# Altium schematic sheet Power.SchDoc
size A4
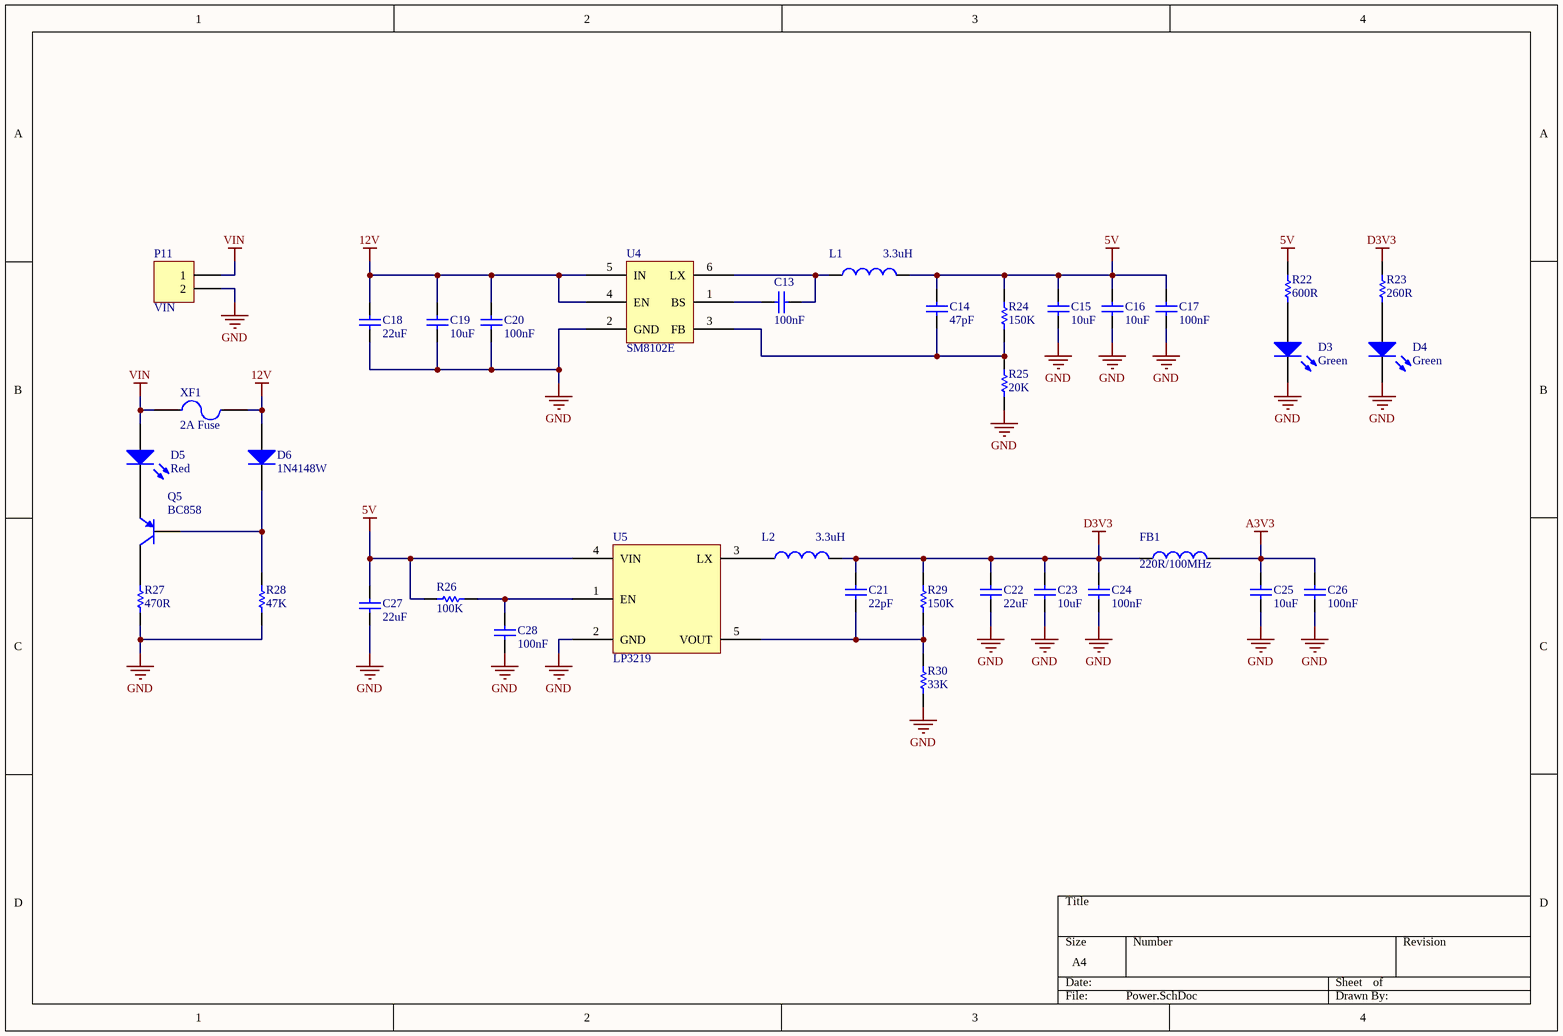
[diagram p0: Power.SchDoc]

## Parts
C13  100nF  [CAP0603]
C14  47pF  [CAP0603]
C15  10uF  [CAP0805]
C16  10uF  [CAP0805]
C17  100nF  [CAP0603]
C18  22uF  [CAP0805]
C19  10uF  [CAP0805]
C20  100nF  [CAP0603]
C21  22pF  [CAP0603]
C22  22uF  [CAP0805]
C23  10uF  [CAP0805]
C24  100nF  [CAP0603]
C25  10uF  [CAP0805]
C26  100nF  [CAP0603]
C27  22uF  [CAP0805]
C28  100nF  [CAP0603]
D3  Green  [DIODE0603]
D4  Green  [DIODE0603]
D5  Red  [DIODE0603]
D6  1N4148W  [SOD-123]
FB1  220R/100MHz  [IND0603]
L1  3.3uH  [IND4x4x1.8]
L2  3.3uH  [IND4x4x1.8]
P11  VIN  [SCREW TERMINAL 5MM]
Q5  BC858  [SOT-23]
R22  600R  [RES0603]
R23  260R  [RES0603]
R24  150K  [RES0603]
R25  20K  [RES0603]
R26  100K  [RES0603]
R27  470R  [RES0603]
R28  47K  [RES0603]
R29  150K  [RES0603]
R30  33K  [RES0603]
U4  SM8102E  [SOT-23-6]
U5  LP3219  [SOT-23-5]
XF1  2A Fuse  [ATO Fuse Holder SMD]

## Nets
5V: C14.2 C15.2 C16.2 C17.2 C27.2 L1.2 R22.2 R24.2 R26.2 U5.4(VIN)
12V: C18.2 C19.2 C20.2 D6.1(A) U4.4(EN) U4.5(IN) XF1.2
A3V3: C25.2 C26.2 FB1.2
D3V3: C21.2 C22.2 C23.2 C24.2 FB1.1 L2.2 R23.2 R29.2
GND: C15.1 C16.1 C17.1 C18.1 C19.1 C20.1 C22.1 C23.1 C24.1 C25.1 C26.1 C27.1 C28.1 D3.2(K) D4.2(K) P11.2 R25.1 R27.1 R28.1 R30.1 U4.2(GND) U5.2(GND)
VIN: D5.1(A) P11.1 XF1.1
NetC13_1: C13.1 L1.1 U4.6(LX)
NetC13_2: C13.2 U4.1(BS)
NetC14_1: C14.1 R24.1 R25.2 U4.3(FB)
NetC21_1: C21.1 R29.1 R30.2 U5.5(VOUT)
NetC28_2: C28.2 R26.1 U5.1(EN)
NetD3_1: D3.1(A) R22.1
NetD4_1: D4.1(A) R23.1
NetD5_2: D5.2(K) Q5.2(E)
NetD6_2: D6.2(K) Q5.1(B) R28.2
NetL2_1: L2.1 U5.3(LX)
NetQ5_3: Q5.3(C) R27.2

## Library data of the parts
C13-C28 = Capacitor: Published: 8-Jun-2000; LatestRevisionDate: 17-Jul-2002; LatestRevisionNote: Re-released for DXP Platform.; PackageReference: RAD-0.3; Publisher: Altium Limited; PackageDescription: Radial Cap, Thru-Hole; 2 Leads; 0.3 in Pin Spacing; Value: Value
D3-D5 = LED: Light Emitting Diode; Published: 8-Jun-2000; LatestRevisionDate: 17-Jul-2002; LatestRevisionNote: Re-released for DXP Platform.; PackageVersion: Sep-1996; PackageReference: SMC; Publisher: Altium Limited; PackageDescription: DO-214-AB/SMC; 2 C-Bend Leads; Body 7.9 x 5.9 mm, inc. leads (LxW); Code_JEDEC: DO-214-AB
D6 = Diode
FB1 = Inductor: Ferrite Bead; Code_IEC: 1005; Published: 8-Jun-2000; LatestRevisionDate: 29-May-2009; LatestRevisionNote: IPC-7351 Footprint Added.; PackageReference: 0402-A; Publisher: Altium Limited; PackageDescription: Chip Inductor; Code_JEITA: 0402; Value: Value
L1 L2 = Inductor: Code_IEC: 1005; Published: 8-Jun-2000; LatestRevisionDate: 29-May-2009; LatestRevisionNote: IPC-7351 Footprint Added.; PackageReference: 0402-A; Publisher: Altium Limited; PackageDescription: Chip Inductor; Code_JEITA: 0402; Value: 3.3uH
P11 = 2X1 2.54MM: Header, 2-Pin; LatestRevisionDate: 17-Jul-2002; LatestRevisionNote: Re-released for DXP Platform.; Publisher: Altium Limited
Q5 = PNP: PNP Bipolar Transistor; Published: 8-Jun-2000; LatestRevisionDate: 29-May-2009; LatestRevisionNote: IPC-7351 Footprint Added.; PackageVersion: Aug-1999; PackageReference: SOT-23B; Publisher: Altium Limited; PackageDescription: 3-Pin SOT-23 Package 0.95 mm Pitch, 2.4 mm Lead Span
R22-R30 = Resistor: Published: 8-Jun-2000; LatestRevisionDate: 17-Jul-2002; LatestRevisionNote: Re-released for DXP Platform.; PackageReference: AXIAL-0.3; Publisher: Altium Limited; PackageDescription: Axial Device, Thru-Hole; 2 Leads; 0.3 in Pin Spacing; Value: Value
U4 = SM8102E: Adjustable VREG
U5 = LP3219: ADJ 1.5A buck convertor
XF1 = ATO Fuse Holder: Automotive Fuse Holder